# Altium schematic sheet Endstops.SchDoc
size Letter; SheetNumber: 3
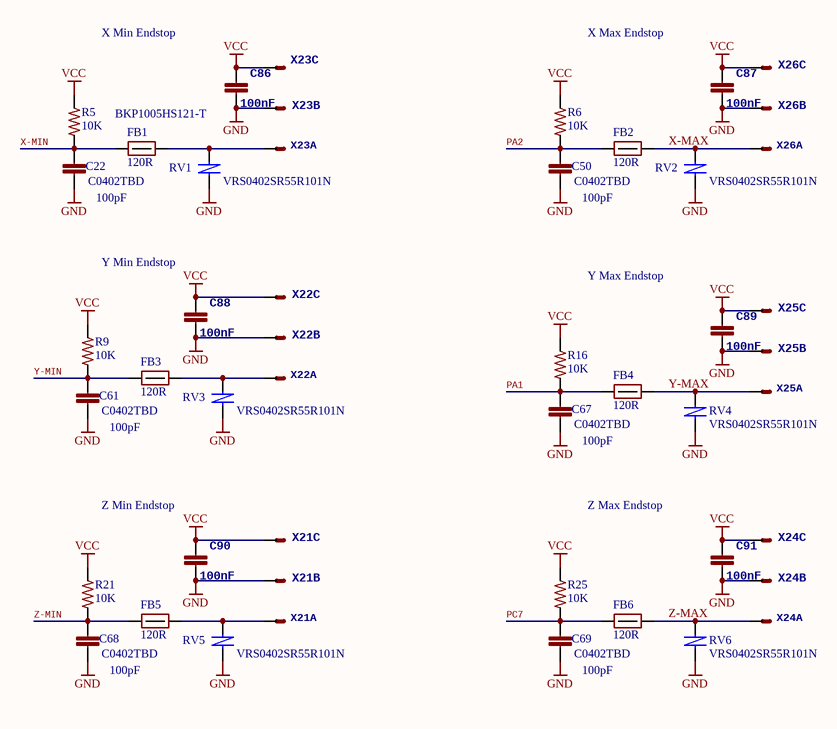
[diagram p0: Endstops.SchDoc]

## Parts
C22  100pF  value C0402TBD  [C0402]
C50  100pF  value C0402TBD  [C0402]
C61  100pF  value C0402TBD  [C0402]
C67  100pF  value C0402TBD  [C0402]
C68  100pF  value C0402TBD  [C0402]
C69  100pF  value C0402TBD  [C0402]
C86  100nF  [C0402]
C87  100nF  [C0402]
C88  100nF  [C0402]
C89  100nF  [C0402]
C90  100nF  [C0402]
C91  100nF  [C0402]
FB1  120R  MANUFACTURER #: BKP1005HS121-T  [R0402]
FB2  120R  [R0402]
FB3  120R  [R0402]
FB4  120R  [R0402]
FB5  120R  [R0402]
FB6  120R  [R0402]
R5  10K  [R0402]
R6  10K  [R0402]
R9  10K  [R0402]
R16  10K  [R0402]
R21  10K  [R0402]
R25  10K  [R0402]
RV1  VRS0402SR55R101N  [C0402]
RV2  VRS0402SR55R101N  [C0402]
RV3  VRS0402SR55R101N  [C0402]
RV4  VRS0402SR55R101N  [C0402]
RV5  VRS0402SR55R101N  [C0402]
RV6  VRS0402SR55R101N  [C0402]
X21  C-GRID-03-70543  [70543-03]  (value not drawn)  (parts A,B,C of 3)
X22  C-GRID-03-70543  [70543-03]  (value not drawn)  (parts A,B,C of 3)
X23  C-GRID-03-70543  [70543-03]  (value not drawn)  (parts A,B,C of 3)
X24  C-GRID-03-70543  [70543-03]  (value not drawn)  (parts A,B,C of 3)
X25  C-GRID-03-70543  [70543-03]  (value not drawn)  (parts A,B,C of 3)
X26  C-GRID-03-70543  [70543-03]  (value not drawn)  (parts A,B,C of 3)

## Nets
GND: C22.2 C50.2 C61.2 C67.2 C68.2 C69.2 C86.1 C87.1 C88.1 C89.1 C90.1 C91.1 RV1.1 RV2.1 RV3.1 RV4.1 RV5.1 RV6.1 X21.2(S) X22.2(S) X23.2(S) X24.2(S) X25.2(S) X26.2(S)
VCC: C86.2 C87.2 C88.2 C89.2 C90.2 C91.2 R5.1 R6.1 R9.1 R16.1 R21.1 R25.1 X21.3(S) X22.3(S) X23.3(S) X24.3(S) X25.3(S) X26.3(S)
PA1: C67.1 FB4.1 R16.2
PA2: C50.1 FB2.1 R6.2
PC7: C69.1 FB6.1 R25.2
X-MAX: FB2.2 RV2.2 X26.1(S)
X-MIN: C22.1 FB1.1 R5.2
Y-MAX: FB4.2 RV4.2 X25.1(S)
Y-MIN: C61.1 FB3.1 R9.2
Z-MAX: FB6.2 RV6.2 X24.1(S)
Z-MIN: C68.1 FB5.1 R21.2
NetFB1_2: FB1.2 RV1.2 X23.1(S)
NetFB3_2: FB3.2 RV3.2 X22.1(S)
NetFB5_2: FB5.2 RV5.2 X21.1(S)

## Notes on the sheet
- X Min Endstop
- X Max Endstop
- Y Min Endstop
- Y Max Endstop
- Z Min Endstop
- Z Max Endstop

## Library data of the parts
C22 C50 C61 C67-C69 = C0402TBD: Capacitor Non Polarized; Manufacturer: Murata; MANUFACTURER #: GRM1555C1H101JA01D; LastRevisionNote: ImportComponents; EE_SPEC: 100pF ±5% 50V Ceramic Capacitor C0G, NP0 0402 (1005 Metric); Published: 23-Apr-2014; Publisher: UltiMachine; LastRevisionDate: 23-Apr-2014
C86-C91 = C-EUC0402: CAPACITOR, European symbol; MANUFACTURER #: GRM155R71C104KA88D; Manufacturer: Murata; EE_SPEC: 16V
FB1 = FERRITE 120R 1A 0402: FERRITE BEAD 120 OHM 0402 1LN; MANUFACTURER: Taiyo Yuden; VALUE: 120Rfb; TOLERANCE: -NA-; EE_SPEC: 1A; DISTRIBUTOR #: 587-1921-2-ND; DISTRIBUTOR: Digikey; PART: FERRITE 120R 1A 0402; PART DESCRIPTION: FERRITE BEAD 120 OHM 0402 1LN
FB2-FB6 = FERRITE 120R 1A 0402: FERRITE BEAD 120 OHM 0402 1LN; MANUFACTURER: Taiyo Yuden; MANUFACTURER #: BKP1005HS121-T; VALUE: 120Rfb; TOLERANCE: -NA-; EE_SPEC: 1A; DISTRIBUTOR #: 587-1921-2-ND; DISTRIBUTOR: Digikey; PART: FERRITE 120R 1A 0402; PART DESCRIPTION: FERRITE BEAD 120 OHM 0402 1LN
R5 R6 R9 R16 R21 R25 = RC0402FR-0710KP: RES SMD 10K OHM 1% 1/16W 0402; MANUFACTURER: Yageo; PART: 10k 1% 0402; PART DESCRIPTION: 10k Ohm ±1% 0.063W, 1/16W Chip Resistor 0402 (1005 Metric) Moisture Resistant Thick Film; VALUE: 10K; MANUFACTURER #: RC0402FR-0710KP; DISTRIBUTOR #: YAG1249TR-ND; DISTRIBUTOR: Digi-Key; TOLERANCE: 1%; EE_SPEC: 10k 1% 0402
RV1-RV6 = VRS0402SR55R101N: Multi-Layer Varistor; Manufacturer: Yageo; Part Description: VARISTOR 12V 10A 0402; Value: 12V; EE_SPEC: 5.5Vdc 12Vvar 60pF; Tolerance: NA; DISTRIBUTOR #: 311-1516-2-ND; DISTRIBUTOR: Digi-Key; MANUFACTURER #: VRS0402SR55R101N; PART: 12V
X21-X26 = C-GRID-03-70543: CONNECTOR   wire to board 2.54 mm (0.100") pitch header; MANUFACTURER #: 70543-0002; Manufacturer: Molex; EE_SPEC: WIRE-BOARD CONNECTOR HEADER 3POS, 2.54MM; OC_FARNELL: unknown; OC_NEWARK: unknown